# Altium project sawtooth,tri.PrjPcb
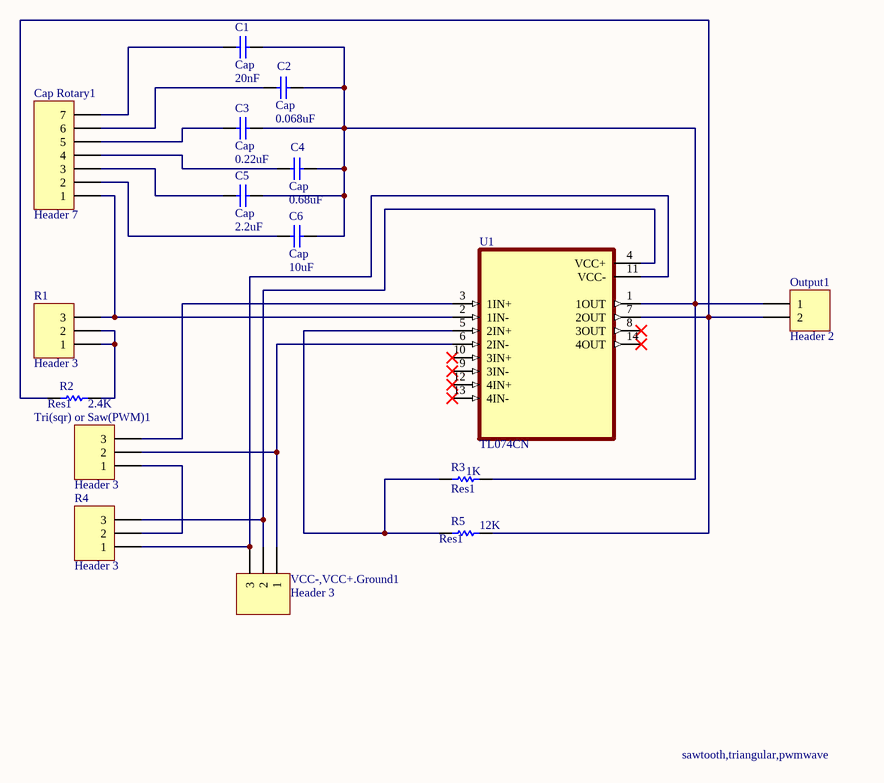
[diagram p0: sawtooth,tri.SchDoc]
1 sheet, 16 parts. Net scope: global (net labels, ports and power ports of the same name join across sheets).
Board file: sawtooth,tri.PcbDoc

## Sheet sawtooth,tri.SchDoc
size A

### Parts
C1  Cap  value 20nF  [RAD-0.3]
C2  Cap  value 0.068uF  [RAD-0.3]
C3  Cap  value 0.22uF  [RAD-0.3]
C4  Cap  value 0.68uF  [RAD-0.3]
C5  Cap  value 2.2uF  [RAD-0.3]
C6  Cap  value 10uF  [RAD-0.3]
Cap_Rotary1  Header 7  [HDR1X7]
Output1  Header 2  [HDR1X2]
R1  Header 3  [HDR1X3]
R2  Res1  value 2.4K  [AXIAL-0.3]
R3  Res1  value 1K  [AXIAL-0.3]
R4  Header 3  [HDR1X3]
R5  Res1  value 12K  [AXIAL-0.3]
Tri(sqr)_or_Saw(PWM)1  Header 3  [HDR1X3]
U1  TL074CN  [DIP794W45P254L1969H508Q14]
VCC-,VCC+.Ground1  Header 3  [HDR1X3]

### Nets
NetC1_1: C1.1 Cap_Rotary1.7
NetC1_2: C1.2 C2.2 C3.2 C4.2 C5.2 C6.2 Output1.1 R3.1 U1.1(1OUT)
NetC2_1: C2.1 Cap_Rotary1.6
NetC3_1: C3.1 Cap_Rotary1.5
NetC4_1: C4.1 Cap_Rotary1.4
NetC5_1: C5.1 Cap_Rotary1.3
NetC6_1: C6.1 Cap_Rotary1.2
NetCap_Rotary1_1: Cap_Rotary1.1 R1.3 U1.2(1IN-)
NetOutput1_2: Output1.2 R2.1 R5.2 U1.7(2OUT)
NetR1_1: R1.1 R1.2 R2.2
NetR3_2: R3.2 R5.1 U1.5(2IN+)
NetR4_1: R4.1 U1.11(VCC-) VCC-,VCC+.Ground1.3
NetR4_2: R4.2 Tri(sqr)_or_Saw(PWM)1.1
NetR4_3: R4.3 U1.4(VCC+) VCC-,VCC+.Ground1.2
NetTri(sqr)_or_Saw(PWM)1_2: Tri(sqr)_or_Saw(PWM)1.2 U1.6(2IN-) VCC-,VCC+.Ground1.1
NetTri(sqr)_or_Saw(PWM)1_3: Tri(sqr)_or_Saw(PWM)1.3 U1.3(1IN+)

Not connected (* = marked no-connect by the designer): U1 8(3OUT)* 9(3IN-)* 10(3IN+)* 12(4IN+)* 13(4IN-)* 14(4OUT)*

### Notes on the sheet
- sawtooth,triangular,pwmwave

### Library data of the parts
C1-C6 = Cap: Capacitor; Published: 8-Jun-2000; LatestRevisionDate: 17-Jul-2002; LatestRevisionNote: Re-released for DXP Platform.; PackageReference: RAD-0.3; Publisher: Altium Limited; PackageDescription: Radial Cap, Thru-Hole; 2 Leads; 0.3 in Pin Spacing
Cap_Rotary1 = Header 7: Header, 7-Pin; LatestRevisionDate: 17-Jul-2002; LatestRevisionNote: Re-released for DXP Platform.; Publisher: Altium Limited
Output1 = Header 2: Header, 2-Pin; LatestRevisionDate: 17-Jul-2002; LatestRevisionNote: Re-released for DXP Platform.; Publisher: Altium Limited
R1 R4 Tri(sqr)_or_Saw(PWM)1 VCC-,VCC+.Ground1 = Header 3: Header, 3-Pin; LatestRevisionDate: 17-Jul-2002; LatestRevisionNote: Re-released for DXP Platform.; Publisher: Altium Limited
R2 R3 R5 = Res1: Resistor; Published: 8-Jun-2000; LatestRevisionDate: 17-Jul-2002; LatestRevisionNote: Re-released for DXP Platform.; PackageReference: AXIAL-0.3; Publisher: Altium Limited; PackageDescription: Axial Device, Thru-Hole; 2 Leads; 0.3 in Pin Spacing
U1 = TL074CN: Quad Low-Noise JFET-Input General-Purpose Operational Amplifier 14-PDIP 0 to 70; MF: Texas Instruments; SnapEDA_Link: https://www.snapeda.com/parts/TL074CN/Texas%20Instruments/view-part/4796371/?ref=snap; Price: None; Mouser-Purchase-URL: https://snapeda.com/shop?store=Mouser&id=4796371; Package: PDIP-14 Texas Instruments; Availability: Good; Texas_Instruments-Purchase-URL: https://snapeda.com/shop?store=Texas+Instruments&id=4796371; MP: TL074CN; DigiKey-Purchase-URL: https://snapeda.com/shop?store=DigiKey&id=4796371; Value: *